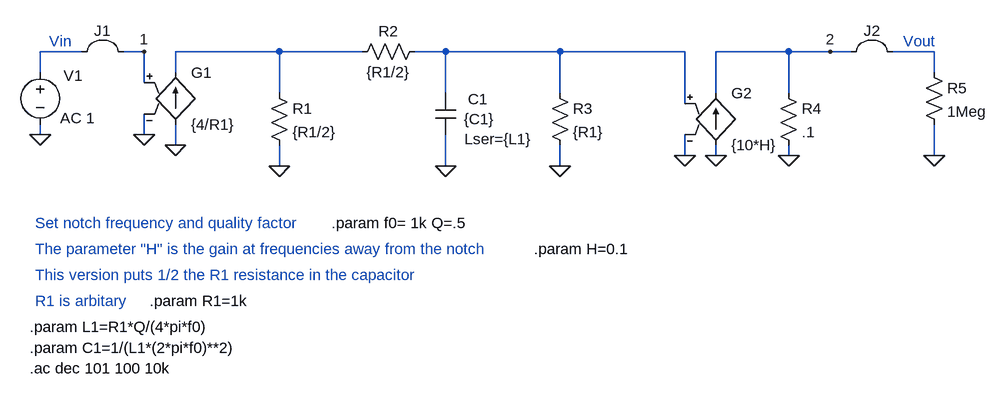
[diagram p0: schematic 2ndOrderNotch.asc]
2ndOrderNotch.asc, the LTspice schematic file:
Version 4
SHEET 1 1060 680
WIRE -624 -112 -688 -112
WIRE -528 -112 -560 -112
WIRE -320 -112 -480 -112
WIRE -192 -112 -320 -112
WIRE -64 -112 -112 -112
WIRE 112 -112 -64 -112
WIRE 304 -112 112 -112
WIRE 464 -112 352 -112
WIRE 528 -112 464 -112
WIRE 560 -112 528 -112
WIRE 688 -112 624 -112
WIRE -688 -80 -688 -112
WIRE -480 -80 -480 -112
WIRE 688 -80 688 -112
WIRE -528 -64 -528 -112
WIRE -320 -48 -320 -112
WIRE -64 -48 -64 -112
WIRE 112 -48 112 -112
WIRE 352 -48 352 -112
WIRE 464 -48 464 -112
WIRE 304 -32 304 -112
WIRE -688 16 -688 0
WIRE -528 16 -528 -16
WIRE -480 32 -480 0
WIRE 304 48 304 16
WIRE 352 48 352 32
WIRE 464 48 464 32
WIRE 688 48 688 0
WIRE -320 64 -320 32
WIRE -64 64 -64 16
WIRE 112 64 112 32
FLAG -320 64 0
FLAG -480 32 0
FLAG -528 16 0
FLAG -64 64 0
FLAG 112 64 0
FLAG 304 48 0
FLAG 352 48 0
FLAG 464 48 0
FLAG 528 -112 2
FLAG -528 -112 1
FLAG -688 16 0
FLAG 688 48 0
SYMBOL g -480 -96 R0
SYMATTR InstName G1
SYMATTR Value {4/R1}
SYMBOL res -336 -64 R0
SYMATTR InstName R1
SYMATTR Value {R1/2}
SYMBOL res -96 -128 R90
WINDOW 0 0 56 VBottom 2
WINDOW 3 32 56 VTop 2
SYMATTR InstName R2
SYMATTR Value {R1/2}
SYMBOL res 96 -64 R0
SYMATTR InstName R3
SYMATTR Value {R1}
SYMBOL cap -80 -48 R0
WINDOW 0 50 9 Left 2
WINDOW 3 44 40 Left 2
WINDOW 123 45 71 Left 2
SYMATTR InstName C1
SYMATTR Value {C1}
SYMATTR Value2 Lser={L1}
SYMBOL g 352 -64 R0
SYMATTR InstName G2
SYMATTR Value {10*H}
SYMBOL res 448 -64 R0
SYMATTR InstName R4
SYMATTR Value .1
SYMBOL Misc\\jumper 592 -176 R0
SYMATTR InstName J2
SYMBOL Misc\\jumper -592 -176 M0
SYMATTR InstName J1
SYMBOL voltage -688 -96 R0
WINDOW 0 36 21 Left 2
WINDOW 123 31 86 Left 2
WINDOW 39 0 0 Left 0
SYMATTR InstName V1
SYMATTR Value2 AC 1
SYMATTR Value ""
SYMBOL res 672 -96 R0
SYMATTR InstName R5
SYMATTR Value 1Meg
TEXT -240 152 Left 2 !.param f0= 1k Q=.5
TEXT -520 272 Left 2 !.param R1=1k
TEXT -704 312 Left 2 !.param L1=R1*Q/(4*pi*f0)
TEXT -696 152 Left 2 ;Set notch frequency and quality factor
TEXT -696 272 Left 2 ;R1 is arbitary
TEXT -696 232 Left 2 ;This version puts 1/2 the R1 resistance in the capacitor
TEXT -704 344 Left 2 !.param C1=1/(L1*(2*pi*f0)**2)
TEXT 640 -128 Left 2 ;Vout
TEXT -640 -128 Right 2 ;Vin
TEXT -704 376 Left 2 !.ac dec 101 100 10k
TEXT 72 192 Left 2 !.param H=0.1
TEXT -696 192 Left 2 ;The parameter "H" is the gain at frequencies away from the notch

The netlist it stands for:
* 2ndOrderNotch.asc
G1 0 N001 1 0 {4/R1}
R1 N001 0 {R1/2}
R2 N002 N001 {R1/2}
R3 N002 0 {R1}
C1 N002 0 {C1} Lser={L1}
G2 0 2 N002 0 {10*H}
R4 2 0 .1
V1 1 0 AC 1
R5 2 0 1Meg
.param f0= 1k Q=.5
.param R1=1k
.param L1=R1*Q/(4*pi*f0)
* Set notch frequency and quality factor
* R1 is arbitary
* This version puts 1/2 the R1 resistance in the capacitor
.param C1=1/(L1*(2*pi*f0)**2)
* Vout
* Vin
.ac dec 101 100 10k
.param H=0.1
* The parameter "H" is the gain at frequencies away from the notch
.backanno
.end